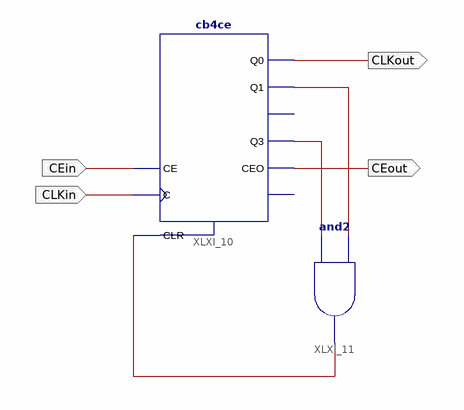
[diagram p0: schematic sheet 1]
// Xilinx ISE schematic Div10.sch (spartan6) as structural Verilog: 2 symbols, 4 ports
module Div10 (
  input  CEin,
  input  CLKin,
  output CLKout,
  output CEout
);

  wire XLXN_5, XLXN_6, XLXN_7;

  cb4ce XLXI_10 (
    .C(CLKin), .CE(CEin), .CLR(XLXN_7), .CEO(CEout), .Q0(CLKout), .Q1(XLXN_6), .Q3(XLXN_5));  // open: Q2, TC
  and XLXI_11 (XLXN_7, XLXN_5, XLXN_6);
endmodule
